# EAGLE design Netzteil_Darlington_v2_Frontpanel (EAGLE 8.6.3)
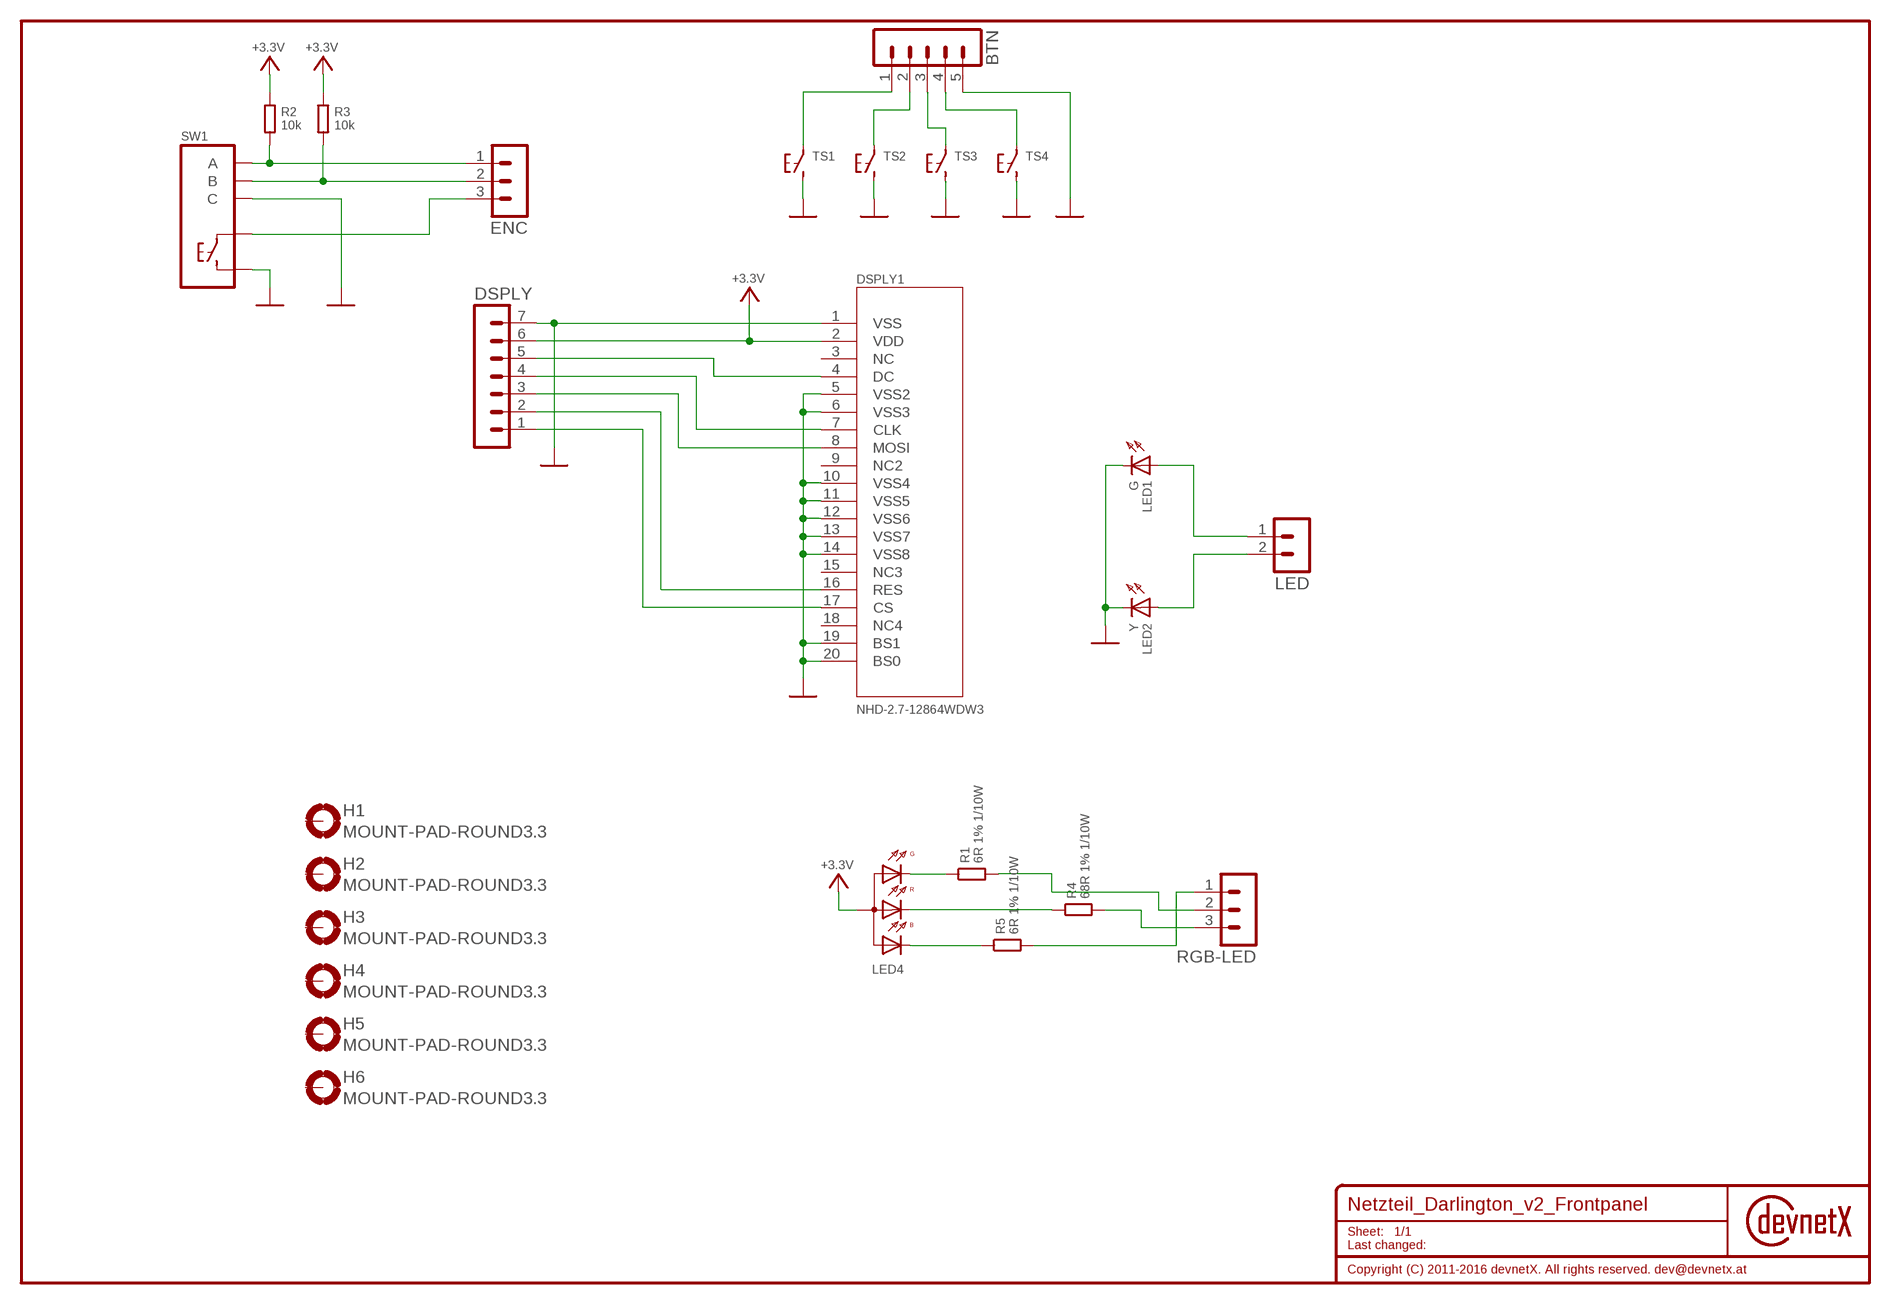
[diagram p0: schematic, sheet 1]

## Parts
BTN  JST-PH-2.0-5P  [JST-PH-2.0-5P]
DNX-NAME-1  DOC-R1.27  [DRAWINGNAME-1.27]
DSPLY  JST-PH-2.0-7P  [JST-PH-2.0-7P]
DSPLY1  NHD-2.7-12864WDW3  [NHD-2.7-12864WDW3]
ENC  JST-PH-2.0-3P  [JST-PH-2.0-3P]
H1  MOUNT-PAD-ROUND3.3  [3,3-PAD]
H2  MOUNT-PAD-ROUND3.3  [3,3-PAD]
H3  MOUNT-PAD-ROUND3.3  [3,3-PAD]
H4  MOUNT-PAD-ROUND3.3  [3,3-PAD]
H5  MOUNT-PAD-ROUND3.3  [3,3-PAD]
H6  MOUNT-PAD-ROUND3.3  [3,3-PAD]
LED  JST-PH-2.0-2P  [JST-PH-2.0-2P]
LED1  G  LED0805  [LED0805]
LED2  Y  LED0805  [LED0805]
LED4  LED-RGB  [C1411]
R1  6R 1% 1/10W  R-SMD0805  [C0805K]
R2  10k  R-SMD0805  [C0805K]
R3  10k  R-SMD0805  [C0805K]
R4  68R 1% 1/10W  R-SMD0805  [C0805K]
R5  6R 1% 1/10W  R-SMD0805  [C0805K]
RGB-LED  JST-PH-2.0-3P  [JST-PH-2.0-3P]
SW1  EC12E-SW  [EC12E-SW]
TS1  TS1B3F-10XX  [B3F-10XX]
TS2  TS1B3F-10XX  [B3F-10XX]
TS3  TS1B3F-10XX  [B3F-10XX]
TS4  TS1B3F-10XX  [B3F-10XX]

## Nets
+3.3V: DSPLY1.2(VDD) DSPLY.6 LED4.1(A) R2.1 R3.1
N$1: LED1.A LED.1
N$2: LED2.A LED.2
N$3: DSPLY1.4(DC) DSPLY.5
N$5: BTN.1 TS1.1
N$6: ENC.1 R2.2 SW1.A
N$7: DSPLY1.7(CLK) DSPLY.4
N$8: DSPLY1.8(MOSI) DSPLY.3
N$9: LED4.4(C4) R1.1
N$10: ENC.2 R3.2 SW1.B
N$11: ENC.3 SW1.1
N$12: BTN.2 TS2.1
N$13: BTN.3 TS3.1
N$14: BTN.4 TS4.1
N$15: LED4.3(C3) R4.1
N$16: DSPLY1.16(RES) DSPLY.2
N$17: DSPLY1.17(CS) DSPLY.1
N$18: LED4.2(C2) R5.1
N$19: R5.2 RGB-LED.1
N$20: R4.2 RGB-LED.3
N$21: R1.2 RGB-LED.2
VSS: BTN.5 DSPLY1.1(VSS) DSPLY1.5(VSS2) DSPLY1.6(VSS3) DSPLY1.10(VSS4) DSPLY1.11(VSS5) DSPLY1.12(VSS6) DSPLY1.13(VSS7) DSPLY1.14(VSS8) DSPLY1.19(BS1) DSPLY1.20(BS0) DSPLY.7 LED1.C LED2.C SW1.2 SW1.C TS1.3 TS2.3 TS3.3 TS4.3
Unconnected: DSPLY1.3(NC) DSPLY1.9(NC2) DSPLY1.15(NC3) DSPLY1.18(NC4) H1.B3,3(MOUNT) H2.B3,3(MOUNT) H3.B3,3(MOUNT) H4.B3,3(MOUNT) H5.B3,3(MOUNT) H6.B3,3(MOUNT)

## Library data of the parts
BTN = neumluc:JST-PH-2.0-5P: PIN HEADER; OC_MOUSER: 455-1707-ND
DNX-NAME-1 = devnetx:DOC-R: devnetX Document Right
DSPLY = neumluc:JST-PH-2.0-7P: PIN HEADER; OC_MOUSER: 455-1709-ND
DSPLY1 = neumluc:NHD-2.7-12864WDW3; OC_MOUSER: 763-NHD2712864WDW3
ENC RGB-LED = neumluc:JST-PH-2.0-3P: PIN HEADER; OC_MOUSER: 455-1705-ND
H1-H6 = holes:MOUNT-PAD-ROUND: MOUNTING PAD, round
LED = neumluc:JST-PH-2.0-2P: PIN HEADER; OC_MOUSER: 455-1704-ND
LED1 = neumluc:LED: LED; OC_MOUSER: 710-150080GS75000
LED2 = neumluc:LED: LED; OC_MOUSER: 710-150080YS75000
LED4 = neumluc:LED-RGB: LED; OC_MOUSER: 710-150141M173100
R1 R5 = neumluc:R-SMD: R SMD; OC_MOUSER: 652-CR0805-J/-6R2ELF
R2 R3 = neumluc:R-SMD: R SMD; OC_MOUSER: 652-CR0805-JW-103ELF
R4 = neumluc:R-SMD: R SMD; OC_MOUSER: 652-CR0805FX-68R0ELF
SW1 = goujine:EC12E-SW: ALPS ENCODER EC12-E with switch; OC_MOUSER: 652-PEC11R-4225F-S24
TS1-TS4 = goujine:TS1; OC_MOUSER: 653-B3F-1022

## Board
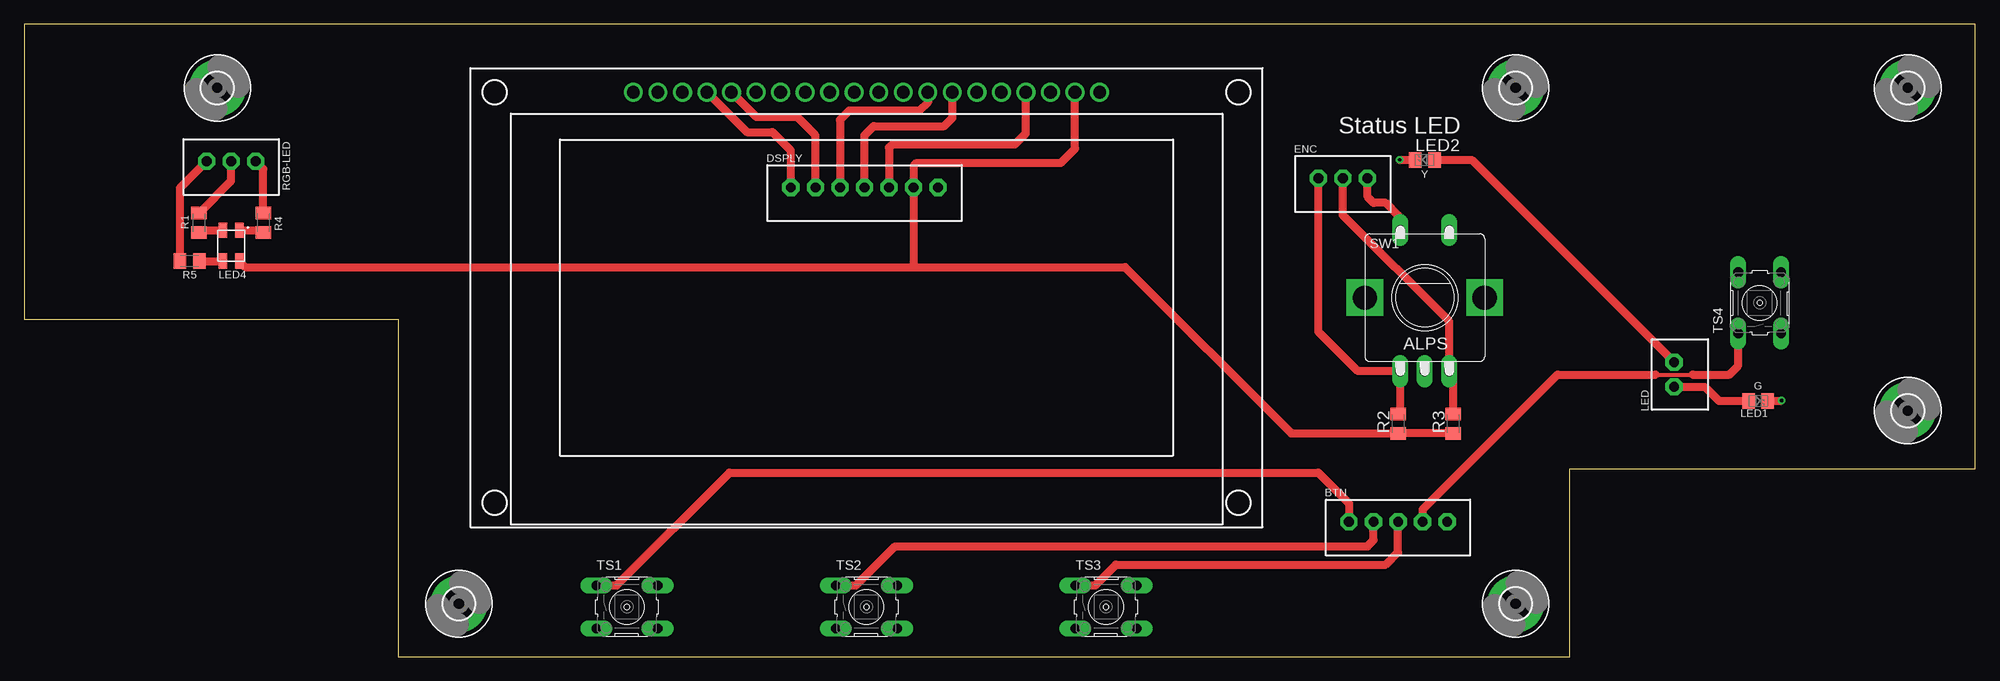
[diagram p1: board, top side]
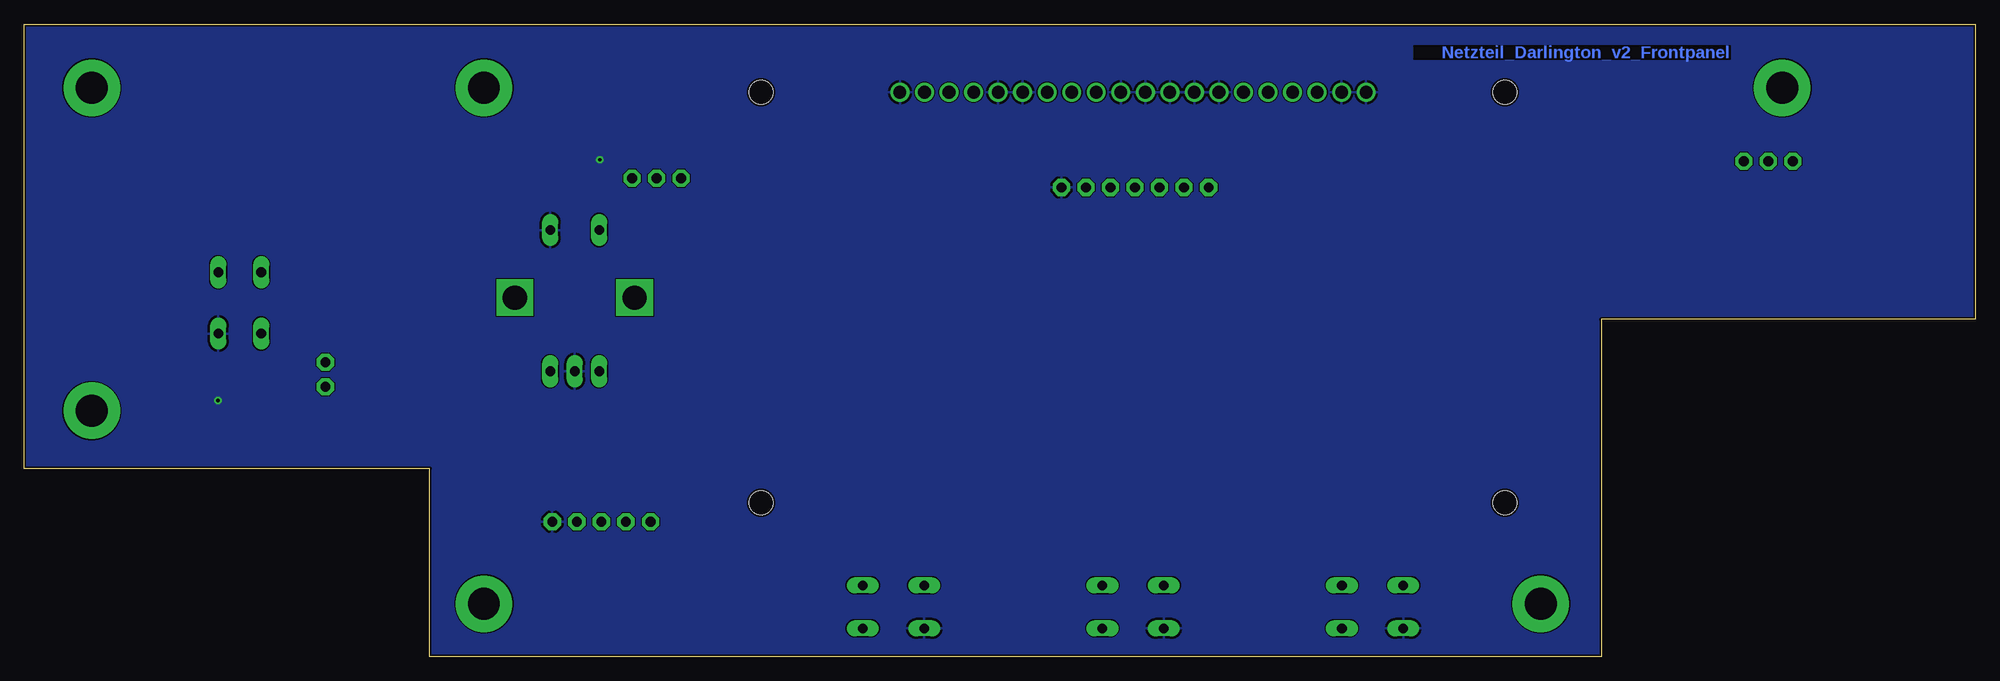
[diagram p2: board, bottom side, seen from below]

Size 202 x 65.47 mm. Coordinates in mm from the lower left corner, seen from the top.
Outline: 38.73,0 160,0 160,19.48 202,19.48 202,65.47 0,65.47 0,34.92 38.73,34.92 38.73,0
Copper layers (1*16): Top 0.035mm / dielectric 1.5mm / Bottom 0.035mm
Design rules "default *": minimum track width 5mil, minimum drill 0.35mm, track to track 5mil, track to pad 5mil, pad to pad 5mil, via to via 5mil, smd to smd 5mil, copper to edge 8mil, drill to drill 6mil, minimum pad ring 10mil, minimum via ring 8mil, stop-mask expansion 4mil, vias tented up to drill 0mil, thermal gap 10mil

### Footprints (pad centres in the part's own frame; a part is rotated, then mirrored left to right if it is on the bottom)
JST-PH-2.0-5P = drill 1.016 pad 1.778 octagon: 1 -5.08,0; 2 -2.54,0; 3 0,0; 4 2.54,0; 5 5.08,0
JST-PH-2.0-7P = drill 1.016 pad 1.778 octagon: 1 -7.62,0; 2 -5.08,0; 3 -2.54,0; 4 0,0; 5 2.54,0; 6 5.08,0; 7 7.62,0
NHD-2.7-12864WDW3 = drill 1.3 pad 1.93: 1 24.13,21.25; 2 21.59,21.25; 3 19.05,21.25; 4 16.51,21.25; 5 13.97,21.25; 6 11.43,21.25; 7 8.89,21.25; 8 6.35,21.25; 9 3.81,21.25; 10 1.27,21.25; 11 -1.27,21.25; 12 -3.81,21.25; 13 -6.35,21.25; 14 -8.89,21.25; 15 -11.43,21.25; 16 -13.97,21.25; 17 -16.51,21.25; 18 -19.05,21.25; 19 -21.59,21.25; 20 -24.13,21.25 | hole 2.5: -38.5,21.25; -38.5,-21.25; 38.5,-21.25; 38.5,21.25
JST-PH-2.0-3P = drill 1.016 pad 1.778 octagon: 1 -2.54,0; 2 0,0; 3 2.54,0
3,3-PAD = drill 3.3 pad 5.842: B3,3 0,0
JST-PH-2.0-2P = drill 1.016 pad 1.778 octagon: 1 -1.27,0; 2 1.27,0
LED0805 = smd 1.3 x 1.6: A 1,0; C -1,0
C1411 = smd 1.6 x 0.9: 1 1.6,0.85; 2 1.6,-0.85; 3 -1.6,0.85; 4 -1.6,-0.85
C0805K = smd 1.3 x 1.6: 1 -1,0; 2 1,0
EC12E-SW = drill 1 pad 1.676 long: 1 -2.54,6.985; 2 2.54,6.985; A -2.54,-7.62; B 2.54,-7.62; C 0,-7.62 | drill 2.5 pad 3.81 square: MOUNT1 -6.2,0; MOUNT2 6.2,0
B3F-10XX = drill 1 pad 1.676 long: 1 -3.175,1.905; 2 3.175,1.905; 3 -3.175,-2.54; 4 3.175,-2.54

### Placement (x,y rotation side)
BTN  142.24,13.97 0 top
DNX-NAME-1  25.4,63.18 180 top
DSPLY  87,48.58 0 top
DSPLY1  87.2,37.17 0 top
ENC  136.53,49.53 0 top
H1  20,58.88 0 top
H2  45,5.47 0 top
H3  154.4,5.47 0 top
H4  154.4,58.88 0 top
H5  195,58.88 0 top
H6  195,25.48 0 top
LED  170.81,29.21 90 top
LED1  179.5,26.48 180 top
LED2  145,51.44 0 top
LED4  21.43,42.55 270 top
R1  18.1,44.93 90 top
R2  142.24,24.13 90 top
R3  147.96,24.13 90 top
R4  24.77,44.93 90 top
R5  17.14,40.96 180 top
RGB-LED  21.43,51.28 0 top
SW1  145,37.17 0 top
TS1  62.4,5.47 0 top
TS2  87.2,5.47 0 top
TS3  112,5.47 0 top
TS4  179.36,36.62 90 top

### Tracks (layer width: path | path; a pad name or v marks a point on that pad's centre or on a via)
+3.3V
  Top 0.813: R3.1 R2.1 131.18,23.13 113.98,40.32 92.08,40.32 | DSPLY1.2 108.79,52.59 107.31,51.12 92.39,51.12 92.08,50.8 DSPLY.6 92.08,40.32 | LED4.1 22.9,40.32 92.08,40.32
N$1
  Top 0.813: LED1.A 175.46,26.48 173.99,27.94 LED.1
N$2
  Top 0.813: LED2.A 149.86,51.44 LED.2
N$3
  Top 0.813: DSPLY1.4 103.71,54.18 102.55,53.02 89.85,53.02 89.53,52.7 DSPLY.5
N$5
  Top 0.813: TS1.1 61.35,7.38 73.03,19.05 133.99,19.05 137.16,15.88 BTN.1
N$6
  Top 0.813: R2.2 142.46,25.35 SW1.A 138.09,29.55 133.99,33.66 ENC.1
N$7
  Top 0.813: DSPLY1.7 96.09,55.77 95.25,54.93 87.95,54.93 87,53.98 DSPLY.4
N$8
  Top 0.813: DSPLY1.8 93.55,57.35 92.71,56.52 85.41,56.52 84.45,55.56 DSPLY.3
N$9
  Top 0.813: R1.1 18.32,44.15 LED4.4
N$10
  Top 0.813: R3.2 147.96,29.14 SW1.B 147.54,34.7 136.53,45.72 ENC.2
N$11
  Top 0.813: SW1.1 142.24,44.38 142.24,45.72 140.97,46.99 139.7,46.99 139.06,47.62 ENC.3
N$12
  Top 0.813: TS2.1 86.12,7.38 90.17,11.43 139.06,11.43 139.7,12.06 BTN.2
N$13
  Top 0.813: TS3.1 110.89,7.38 113.03,9.53 140.97,9.53 142.24,10.79 BTN.3
N$14
  Top 0.406: 168.91,29.21 172.72,29.21
  Top 0.813: 168.91,29.21 158.75,29.21 144.78,15.24 BTN.4 | 172.72,29.21 176.53,29.21 177.46,30.14 TS4.1
N$15
  Top 0.813: LED4.3 24.55,44.15 R4.1
N$16
  Top 0.813: DSPLY1.16 75.78,55.88 80.01,55.88 81.92,53.98 DSPLY.2
N$17
  Top 0.813: DSPLY1.17 74.82,54.29 77.47,54.29 79.38,52.39 DSPLY.1
N$18
  Top 0.813: R5.1 20.57,40.96 LED4.2
N$19
  Top 0.813: R5.2 16.14,48.53 RGB-LED.1
N$20
  Top 0.813: R4.2 24.77,50.48 RGB-LED.3
N$21
  Top 0.813: R1.2 21.43,49.26 RGB-LED.2
VSS  (via drill 0.35)
  Top 0.813: LED1.C 180.54,26.51 v181.93,26.51 | v142.4,51.44 LED2.C
  pour Bottom: 38.73,0 160.02,0 160.02,19.53 201.93,19.53 201.93,65.41 0,65.41 0,34.92 38.73,34.92

### Text on the board
tNames: Status LED | Y | G
Notes: Power LED | Output ON LED